# Altium schematic sheet rs232_conn.SchDoc
size A4
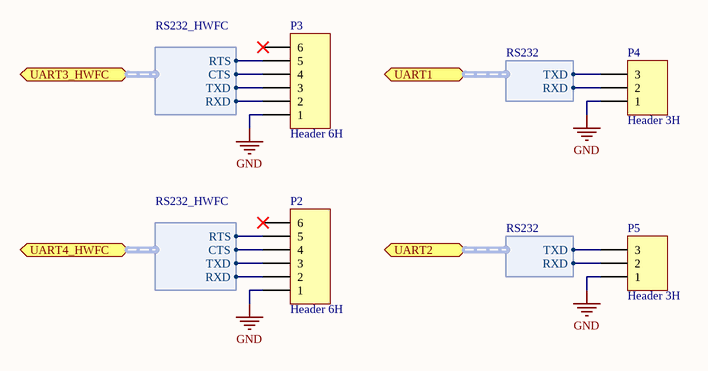
[diagram p0: rs232_conn.SchDoc]

## Parts
P2  Header 6H  [S06B-PASK-2]
P3  Header 6H  [S06B-PASK-2]
P4  Header 3H  [S03B-PASK-2]
P5  Header 3H  [S03B-PASK-2]

## Ports
UART1 (harness RS232), UART2 (harness RS232), UART3_HWFC (harness RS232_HWFC), UART4_HWFC (harness RS232_HWFC)

## Harnesses
RS232_HWFC: CTS, RTS, RXD, TXD
RS232: TXD, RXD

## Nets
GND: P2.1 P3.1 P4.1 P5.1
NetP2_2: P2.2 ; port UART4_HWFC.RXD
NetP2_3: P2.3 ; port UART4_HWFC.TXD
NetP2_4: P2.4 ; port UART4_HWFC.CTS
NetP2_5: P2.5 ; port UART4_HWFC.RTS
NetP3_2: P3.2 ; port UART3_HWFC.RXD
NetP3_3: P3.3 ; port UART3_HWFC.TXD
NetP3_4: P3.4 ; port UART3_HWFC.CTS
NetP3_5: P3.5 ; port UART3_HWFC.RTS
NetP4_2: P4.2 ; port UART1.RXD
NetP4_3: P4.3 ; port UART1.TXD
NetP5_2: P5.2 ; port UART2.RXD
NetP5_3: P5.3 ; port UART2.TXD

Not connected (* = marked no-connect by the designer): P2 6*; P3 6*

## Library data of the parts
P2 P3 = Header 6H: Header, 6-Pin, Right Angle; LatestRevisionDate: 17-Jul-2002; LatestRevisionNote: Re-released for DXP Platform.; Publisher: Altium Limited; farnell: 1830751
P4 P5 = Header 3H: Header, 3-Pin, Right Angle; LatestRevisionDate: 17-Jul-2002; LatestRevisionNote: Re-released for DXP Platform.; Publisher: Altium Limited; farnell: 1830748